# Altium project smartwatch.PrjPcb
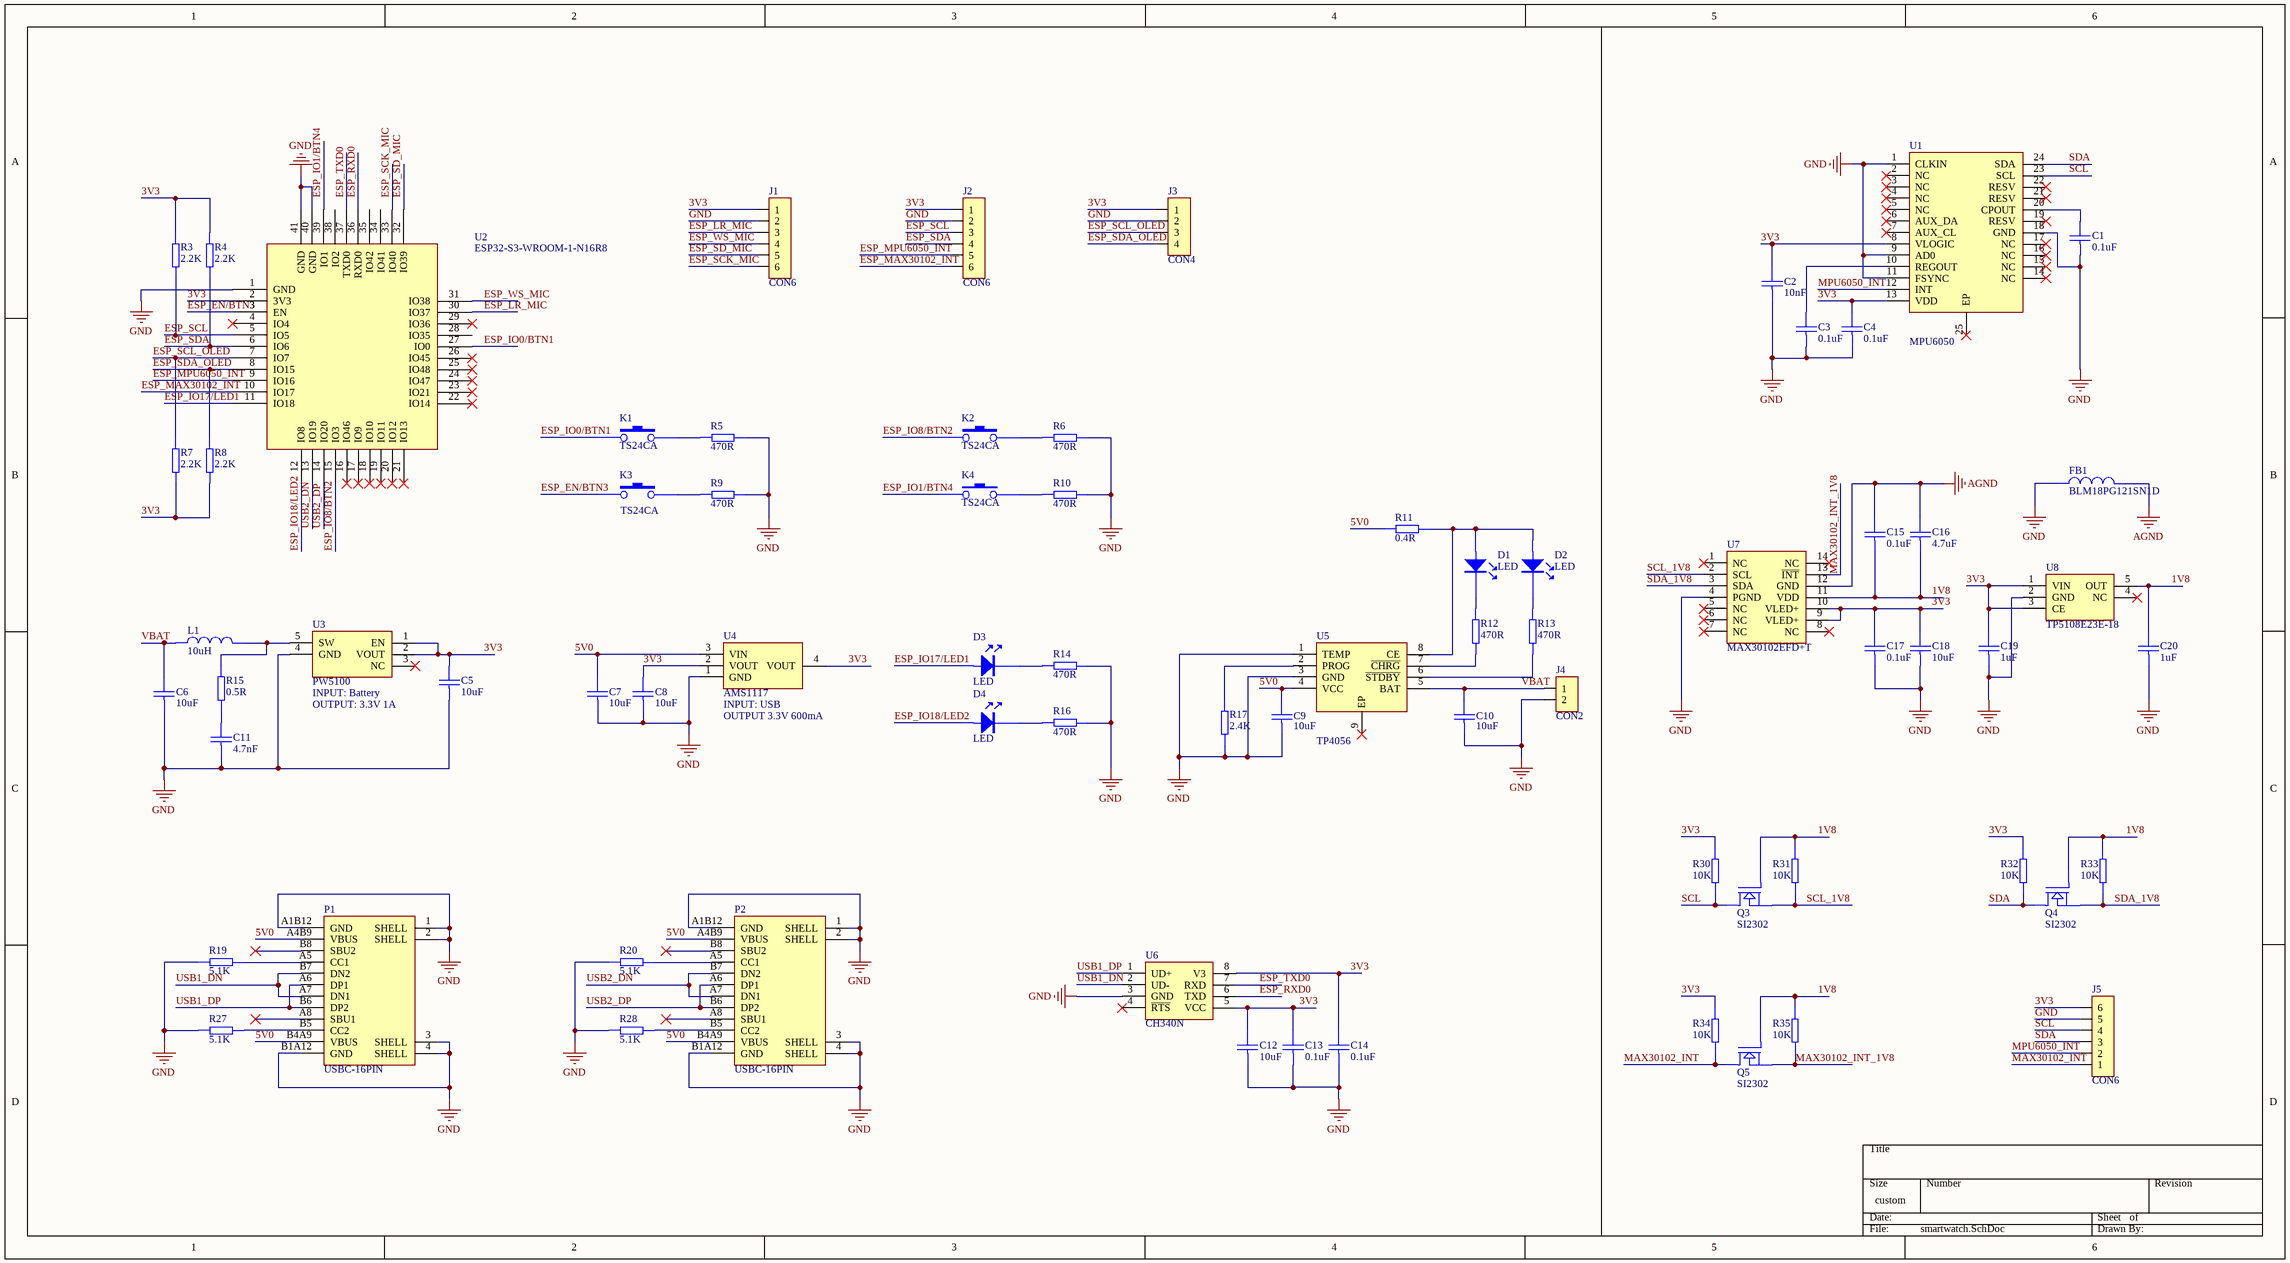
[diagram p0: smartwatch.SchDoc]
1 sheet, 73 parts. Net scope: global (net labels, ports and power ports of the same name join across sheets).
Board file: smartwatch.PcbDoc

## Sheet smartwatch.SchDoc
size 508 x 279 mm; Author: TrWyFowrd; DrawnBy: TrWyFowrd; SheetNumber: 1; SheetTotal: 1

### Parts
C1  0.1uF  [0603]
C2  10nF  [0603]
C3  0.1uF  [0603]
C4  0.1uF  [0603]
C5  10uF  [0603]
C6  10uF  [0603]
C7  10uF  [0603]
C8  10uF  [0603]
C9  10uF  [0603]
C10  10uF  [0603]
C11  4.7nF  [0603]
C12  10uF  [0603]
C13  0.1uF  [0603]
C14  0.1uF  [0603]
C15  0.1uF  [0603]
C16  4.7uF  [0603]
C17  0.1uF  [0603]
C18  10uF  [0603]
C19  1uF  [0603]
C20  1uF  [0603]
D1  LED  [LED0805-R-RD]
D2  LED  [LED0805-R-RD]
D3  LED  [LED0805-R-RD]
D4  LED  [LED0805-R-RD]
FB1  BLM18PG121SN1D  [0603]
J1  CON6  [FPC-SMD_P0.50-6P_AFC01-S06FCA-00]
J2  CON6  [FPC-SMD_P0.50-6P_AFC01-S06FCA-00]
J3  CON4  [HDR2.54-M-LI-4P]
J4  CON2  [SIP-1.25-2P]
J5  CON6  [FPC-SMD_P0.50-6P_AFC01-S06FCA-00]
K1  TS24CA  [SW-SMD_TS24CA]
K2  TS24CA  [SW-SMD_TS24CA]
K3  TS24CA  [SW-SMD_TS24CA]
K4  TS24CA  [SW-SMD_TS24CA]
L1  10uH  [IND-SMD_L5.4-W5.2_FXL0530]
P1  USBC-16PIN  [USB-C-SMD_G-SWITCH_GT-USB-7010ASV]
P2  USBC-16PIN  [USB-C-SMD_G-SWITCH_GT-USB-7010ASV]
Q3  SI2302  [SOT-23-3_L2.9-W1.3-P1.90-LS2.4-BR]
Q4  SI2302  [SOT-23-3_L2.9-W1.3-P1.90-LS2.4-BR]
Q5  SI2302  [SOT-23-3_L2.9-W1.3-P1.90-LS2.4-BR]
R3  2.2K  [0603]
R4  2.2K  [0603]
R5  470R  [0603]
R6  470R  [0603]
R7  2.2K  [0603]
R8  2.2K  [0603]
R9  470R  [0603]
R10  470R  [0603]
R11  0.4R  [2512]
R12  470R  [0603]
R13  470R  [0603]
R14  470R  [0603]
R15  0.5R  [0603]
R16  470R  [0603]
R17  2.4K  [0603]
R19  5.1K  [0603]
R20  5.1K  [0603]
R27  5.1K  [0603]
R28  5.1K  [0603]
R30  10K  [0603]
R31  10K  [0603]
R32  10K  [0603]
R33  10K  [0603]
R34  10K  [0603]
R35  10K  [0603]
U1  MPU6050  [QFN-24_L4.0-W4.0-P0.50-BL-EP2.7]
U2  ESP32-S3-WROOM-1-N16R8  [WIRELM-SMD_ESP32-S3-WROOM-1_reduced]
U3  PW5100  [SOT95P280X125-5N]
U4  AMS1117  [SOT223]
U5  TP4056  [ESOP-8_L4.9-W3.9-P1.27-LS6.0-BL-EP]
U6  CH340N  [SOP-8_L4.9-W3.9-P1.27-LS6.0-BL]
U7  MAX30102EFD+T  [OESIP-14_L5.6-W3.3-P0.80-TL]
U8  TP5108E23E-18  [SOT-23-5_L3.0-W1.7-P0.95-LS2.8-BL]

### Nets
AGND: C15.2 C16.2 FB1.2 U7.12(GND)
GND: C1.1 C2.1 C3.1 C4.1 C5.1 C6.1 C7.1 C8.1 C9.1 C10.1 C11.1 C12.1 C13.1 C14.1 C17.1 C18.1 C19.1 C20.1 FB1.1 J1.2 J2.2 J3.2 J4.2 J5.5 P1.1(SHELL) P1.2(SHELL) P1.3(SHELL) P1.4(SHELL) P1.A1B12(GND) P1.B1A12(GND) P2.1(SHELL) P2.2(SHELL) P2.3(SHELL) P2.4(SHELL) P2.A1B12(GND) P2.B1A12(GND) R5.2 R6.2 R9.2 R10.2 R14.1 R16.1 R17.2 R19.1 R20.1 R27.1 R28.1 U1.1(CLKIN) U1.9(AD0) U1.11(FSYNC) U1.18(GND) U2.1(GND) U2.40(GND) U2.41(GND) U3.4(GND) U4.1(GND) U5.1(TEMP) U5.3(GND) U6.3(GND) U7.4(PGND) U8.2(GND)
1V8: C15.1 C16.1 C20.2 Q3.1(G) Q4.1(G) Q5.1(G) R31.2 R33.2 R35.2 U7.11(VDD) U8.5(OUT)
3V3: C2.2 C4.2 C5.2 C8.2 C12.2 C13.2 C14.2 C17.2 C18.2 C19.2 J1.1 J2.1 J3.1 J5.6 R3.2 R4.2 R7.1 R8.1 R30.2 R32.2 R34.2 U1.8(VLOGIC) U1.13(VDD) U2.2(3V3) U3.1(EN) U3.2(VOUT) U4.2(VOUT) U4.4(VOUT) U6.5(VCC) U6.8(V3) U7.9(VLED+) U7.10(VLED+) U8.1(VIN) U8.3(CE)
5V0: C7.2 C9.2 P1.A4B9(VBUS) P1.B4A9(VBUS) P2.A4B9(VBUS) P2.B4A9(VBUS) R11.2 U4.3(VIN) U5.4(VCC)
ESP_EN/BTN3: K3.1 U2.3(EN)
ESP_IO0/BTN1: K1.1 U2.27(IO0)
ESP_IO1/BTN4: K4.2 U2.39(IO1)
ESP_IO8/BTN2: K2.1 U2.15(IO3)
ESP_IO17/LED1: D3.1 U2.11(IO18)
ESP_IO18/LED2: D4.1 U2.12(IO8)
ESP_LR_MIC: J1.3 U2.30(IO37)
ESP_MAX30102_INT: J2.6 U2.10(IO17)
ESP_MPU6050_INT: J2.5 U2.9(IO16)
ESP_RXD0: U2.36(RXD0) U6.6(TXD)
ESP_SCK_MIC: J1.6 U2.33(IO40)
ESP_SCL: J2.3 R3.1 U2.5(IO5)
ESP_SCL_OLED: J3.3 R7.2 U2.7(IO7)
ESP_SD_MIC: J1.5 U2.32(IO39)
ESP_SDA: J2.4 R4.1 U2.6(IO6)
ESP_SDA_OLED: J3.4 R8.2 U2.8(IO15)
ESP_TXD0: U2.37(TXD0) U6.7(RXD)
ESP_WS_MIC: J1.4 U2.31(IO38)
MAX30102_INT: J5.1 Q5.3(D) R34.1
MAX30102_INT_1V8: Q5.2(S) R35.1 U7.13(~{INT})
MPU6050_INT: J5.2 U1.12(INT)
SCL: J5.4 Q3.3(D) R30.1 U1.23(SCL)
SCL_1V8: Q3.2(S) R31.1 U7.2(SCL)
SDA: J5.3 Q4.3(D) R32.1 U1.24(SDA)
SDA_1V8: Q4.2(S) R33.1 U7.3(SDA)
USB1_DN: P1.A7(DN1) P1.B7(DN2) U6.2(UD-)
USB1_DP: P1.A6(DP1) P1.B6(DP2) U6.1(UD+)
USB2_DN: P2.A7(DN1) P2.B7(DN2) U2.13(IO19)
USB2_DP: P2.A6(DP1) P2.B6(DP2) U2.14(IO20)
VBAT: C6.2 C10.2 J4.1 L1.1 U5.5(BAT)
NetC1_2: C1.2 U1.20(CPOUT)
NetC3_2: C3.2 U1.10(REGOUT)
NetC11_2: C11.2 R15.1
NetD1_1: D1.1 D2.1 R11.1 U5.8(CE)
NetD1_2: D1.2 R12.2
NetD2_2: D2.2 R13.2
NetD3_2: D3.2 R14.2
NetD4_2: D4.2 R16.2
NetK1_2: K1.2 R5.1
NetK2_2: K2.2 R6.1
NetK3_2: K3.2 R9.1
NetK4_1: K4.1 R10.1
NetL1_2: L1.2 R15.2 U3.5(SW)
NetP1_A5: P1.A5(CC1) R19.2
NetP1_B5: P1.B5(CC2) R27.2
NetP2_A5: P2.A5(CC1) R20.2
NetP2_B5: P2.B5(CC2) R28.2
NetR12_1: R12.1 U5.7(~{CHRG})
NetR13_1: R13.1 U5.6(~{STDBY})
NetR17_1: R17.1 U5.2(PROG)

Not connected (* = marked no-connect by the designer): P1 A8(SBU1)* B8(SBU2)*; P2 A8(SBU1)* B8(SBU2)*; U1 2(NC)* 3(NC)* 4(NC)* 5(NC)* 6(AUX_DA)* 7(AUX_CL)* 14(NC)* 15(NC)* 16(NC)* 17(NC)* 19(RESV)* 21(RESV)* 22(RESV)* 25(EP)*; U2 4(IO4)* 16(IO46)* 17(IO9)* 18(IO10)* 19(IO11)* 20(IO12)* 21(IO13)* 22(IO14)* 23(IO21)* 24(IO47)* 25(IO48)* 26(IO45)* 28(IO35) 29(IO36)* 34(IO41) 35(IO42) 38(IO2); U3 3(NC)*; U5 9(EP)*; U6 4(~{RTS})*; U7 1(NC)* 5(NC)* 6(NC)* 7(NC)* 8(NC)* 14(NC)*; U8 4(NC)*

### Notes on the sheet
- (near U3) OUTPUT: 3.3V 1A
- (near U3) INPUT: Battery
- (near U4) INPUT: USB
- (near U4) OUTPUT 3.3V 600mA

### Library data of the parts
C1-C20 = C: 电容
FB1 = FB: 磁珠
K1-K4 = TS24CA: 4.55*1.8*3.5mm 卧贴 轻触开关
L1 = L: 电感
P1 P2 = USBC-16PIN: USB Type-C母座 16PIN 卧贴
Q3-Q5 = MOSFET N
R3-R17 R19 R20 R27 R28 R30-R35 = R: 电阻
U1 = MPU6050: 三轴加速度计和三轴陀螺仪，工作电压：2.375V~3.46V
U2 = ESP32-S3-WROOM-1-N16R8: 通用型Wi-Fi+低功耗蓝牙MCU模组
U3 = PW5100: DC-DC
U4 = AMS1117: LDO 线性稳压器
U5 = TP4056: 1A线性锂离子电池充电器
U6 = CH340N: USB2.0芯片CH340N
U7 = MAX30102EFD+T: 高灵敏度脉搏血氧仪和心率传感器
U8 = TP5108E23E-18: LDO 输出1.8V 500mA